# Altium schematic sheet 6_ZynTra-Zynq-DDR Interface.SchDoc
size 381 x 228 mm; SheetNumber: 6; SheetTotal: 10
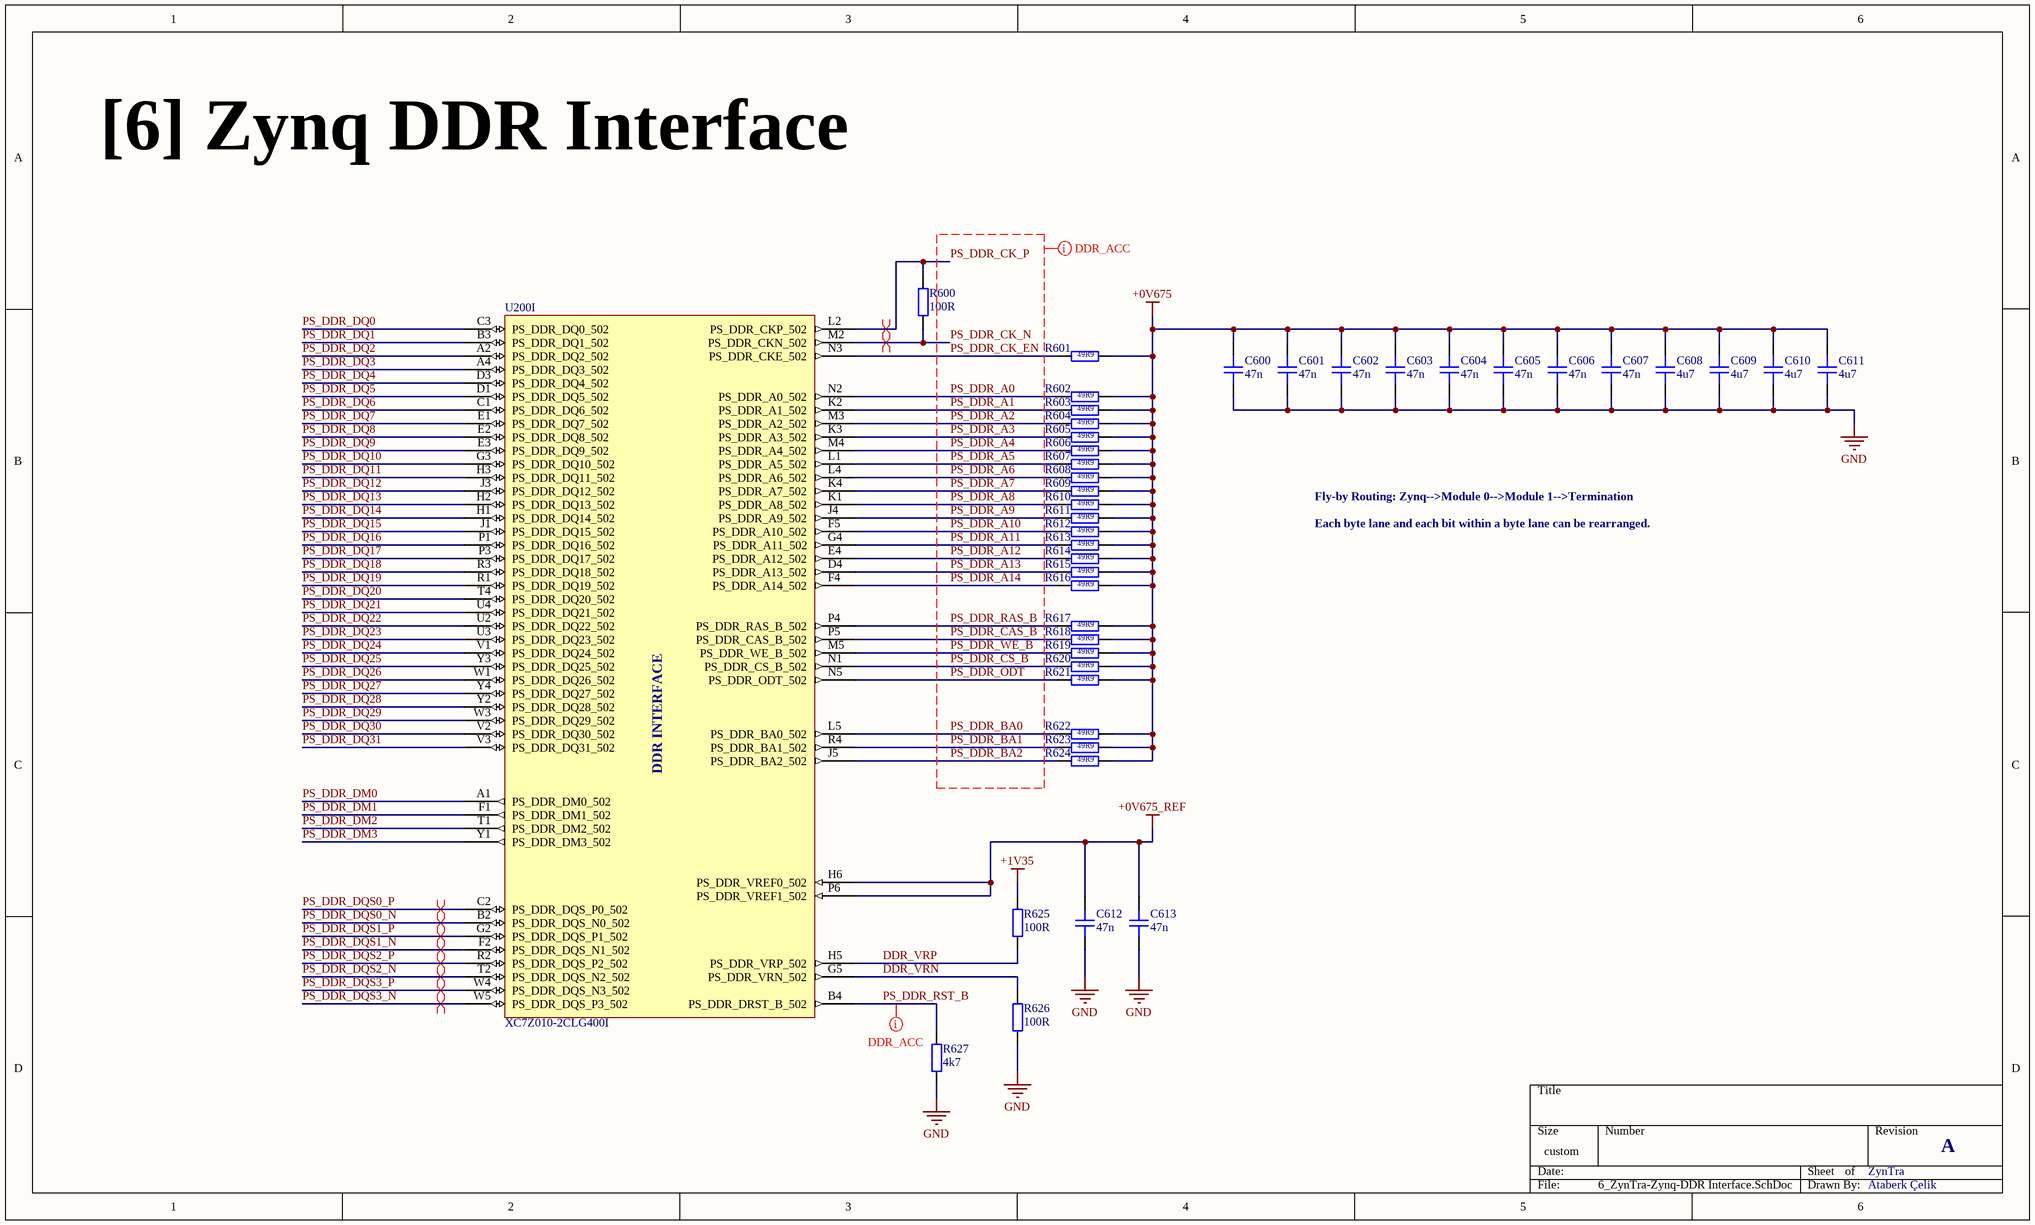
[diagram p0: 6_ZynTra-Zynq-DDR Interface.SchDoc]

## Parts
C600  47n  [CAP_0201]
C601  47n  [CAP_0201]
C602  47n  [CAP_0201]
C603  47n  [CAP_0201]
C604  47n  [CAP_0201]
C605  47n  [CAP_0201]
C606  47n  [CAP_0201]
C607  47n  [CAP_0201]
C608  4u7  [CAP_0402]
C609  4u7  [CAP_0402]
C610  4u7  [CAP_0402]
C611  4u7  [CAP_0402]
C612  47n  [CAP_0201]
C613  47n  [CAP_0201]
R600  100R  [RES_0201]
R601  49R9  [RES_0201]
R602  49R9  [RES_0201]
R603  49R9  [RES_0201]
R604  49R9  [RES_0201]
R605  49R9  [RES_0201]
R606  49R9  [RES_0201]
R607  49R9  [RES_0201]
R608  49R9  [RES_0201]
R609  49R9  [RES_0201]
R610  49R9  [RES_0201]
R611  49R9  [RES_0201]
R612  49R9  [RES_0201]
R613  49R9  [RES_0201]
R614  49R9  [RES_0201]
R615  49R9  [RES_0201]
R616  49R9  [RES_0201]
R617  49R9  [RES_0201]
R618  49R9  [RES_0201]
R619  49R9  [RES_0201]
R620  49R9  [RES_0201]
R621  49R9  [RES_0201]
R622  49R9  [RES_0201]
R623  49R9  [RES_0201]
R624  49R9  [RES_0201]
R625  100R  [RES_0201]
R626  100R  [RES_0201]
R627  4k7  [RES_0201]
U200  XC7Z010-2CLG400I  [CLG400, 0.8mm, 17x17]  (part I of 9)

## Nets
+0V675: C600.2 C601.2 C602.2 C603.2 C604.2 C605.2 C606.2 C607.2 C608.2 C609.2 C610.2 C611.2 R601.2 R602.2 R603.2 R604.2 R605.2 R606.2 R607.2 R608.2 R609.2 R610.2 R611.2 R612.2 R613.2 R614.2 R615.2 R616.2 R617.2 R618.2 R619.2 R620.2 R621.2 R622.2 R623.2 R624.2
+0V675_REF: C612.2 C613.2 U200.H6(PS_DDR_VREF0_502) U200.P6(PS_DDR_VREF1_502)
+1V35: R625.2
GND: C600.1 C601.1 C602.1 C603.1 C604.1 C605.1 C606.1 C607.1 C608.1 C609.1 C610.1 C611.1 C612.1 C613.1 R626.1 R627.1
DDR_VRN: R626.2 U200.G5(PS_DDR_VRN_502)
DDR_VRP: R625.1 U200.H5(PS_DDR_VRP_502)
PS_DDR_A0: R602.1 U200.N2(PS_DDR_A0_502)
PS_DDR_A1: R603.1 U200.K2(PS_DDR_A1_502)
PS_DDR_A2: R604.1 U200.M3(PS_DDR_A2_502)
PS_DDR_A3: R605.1 U200.K3(PS_DDR_A3_502)
PS_DDR_A4: R606.1 U200.M4(PS_DDR_A4_502)
PS_DDR_A5: R607.1 U200.L1(PS_DDR_A5_502)
PS_DDR_A6: R608.1 U200.L4(PS_DDR_A6_502)
PS_DDR_A7: R609.1 U200.K4(PS_DDR_A7_502)
PS_DDR_A8: R610.1 U200.K1(PS_DDR_A8_502)
PS_DDR_A9: R611.1 U200.J4(PS_DDR_A9_502)
PS_DDR_A10: R612.1 U200.F5(PS_DDR_A10_502)
PS_DDR_A11: R613.1 U200.G4(PS_DDR_A11_502)
PS_DDR_A12: R614.1 U200.E4(PS_DDR_A12_502)
PS_DDR_A13: R615.1 U200.D4(PS_DDR_A13_502)
PS_DDR_A14: R616.1 U200.F4(PS_DDR_A14_502)
PS_DDR_BA0: R622.1 U200.L5(PS_DDR_BA0_502)
PS_DDR_BA1: R623.1 U200.R4(PS_DDR_BA1_502)
PS_DDR_BA2: R624.1 U200.J5(PS_DDR_BA2_502)
PS_DDR_CAS_B: R618.1 U200.P5(PS_DDR_CAS_B_502)
PS_DDR_CK_EN: R601.1 U200.N3(PS_DDR_CKE_502)
PS_DDR_CK_N: R600.1 U200.M2(PS_DDR_CKN_502)
PS_DDR_CK_P: R600.2 U200.L2(PS_DDR_CKP_502)
PS_DDR_CS_B: R620.1 U200.N1(PS_DDR_CS_B_502)
PS_DDR_DM0: U200.A1(PS_DDR_DM0_502)
PS_DDR_DM1: U200.F1(PS_DDR_DM1_502)
PS_DDR_DM2: U200.T1(PS_DDR_DM2_502)
PS_DDR_DM3: U200.Y1(PS_DDR_DM3_502)
PS_DDR_DQ0: U200.C3(PS_DDR_DQ0_502)
PS_DDR_DQ1: U200.B3(PS_DDR_DQ1_502)
PS_DDR_DQ2: U200.A2(PS_DDR_DQ2_502)
PS_DDR_DQ3: U200.A4(PS_DDR_DQ3_502)
PS_DDR_DQ4: U200.D3(PS_DDR_DQ4_502)
PS_DDR_DQ5: U200.D1(PS_DDR_DQ5_502)
PS_DDR_DQ6: U200.C1(PS_DDR_DQ6_502)
PS_DDR_DQ7: U200.E1(PS_DDR_DQ7_502)
PS_DDR_DQ8: U200.E2(PS_DDR_DQ8_502)
PS_DDR_DQ9: U200.E3(PS_DDR_DQ9_502)
PS_DDR_DQ10: U200.G3(PS_DDR_DQ10_502)
PS_DDR_DQ11: U200.H3(PS_DDR_DQ11_502)
PS_DDR_DQ12: U200.J3(PS_DDR_DQ12_502)
PS_DDR_DQ13: U200.H2(PS_DDR_DQ13_502)
PS_DDR_DQ14: U200.H1(PS_DDR_DQ14_502)
PS_DDR_DQ15: U200.J1(PS_DDR_DQ15_502)
PS_DDR_DQ16: U200.P1(PS_DDR_DQ16_502)
PS_DDR_DQ17: U200.P3(PS_DDR_DQ17_502)
PS_DDR_DQ18: U200.R3(PS_DDR_DQ18_502)
PS_DDR_DQ19: U200.R1(PS_DDR_DQ19_502)
PS_DDR_DQ20: U200.T4(PS_DDR_DQ20_502)
PS_DDR_DQ21: U200.U4(PS_DDR_DQ21_502)
PS_DDR_DQ22: U200.U2(PS_DDR_DQ22_502)
PS_DDR_DQ23: U200.U3(PS_DDR_DQ23_502)
PS_DDR_DQ24: U200.V1(PS_DDR_DQ24_502)
PS_DDR_DQ25: U200.Y3(PS_DDR_DQ25_502)
PS_DDR_DQ26: U200.W1(PS_DDR_DQ26_502)
PS_DDR_DQ27: U200.Y4(PS_DDR_DQ27_502)
PS_DDR_DQ28: U200.Y2(PS_DDR_DQ28_502)
PS_DDR_DQ29: U200.W3(PS_DDR_DQ29_502)
PS_DDR_DQ30: U200.V2(PS_DDR_DQ30_502)
PS_DDR_DQ31: U200.V3(PS_DDR_DQ31_502)
PS_DDR_DQS0_N: U200.B2(PS_DDR_DQS_N0_502)
PS_DDR_DQS0_P: U200.C2(PS_DDR_DQS_P0_502)
PS_DDR_DQS1_N: U200.F2(PS_DDR_DQS_N1_502)
PS_DDR_DQS1_P: U200.G2(PS_DDR_DQS_P1_502)
PS_DDR_DQS2_N: U200.T2(PS_DDR_DQS_N2_502)
PS_DDR_DQS2_P: U200.R2(PS_DDR_DQS_P2_502)
PS_DDR_DQS3_N: U200.W5(PS_DDR_DQS_P3_502)
PS_DDR_DQS3_P: U200.W4(PS_DDR_DQS_N3_502)
PS_DDR_ODT: R621.1 U200.N5(PS_DDR_ODT_502)
PS_DDR_RAS_B: R617.1 U200.P4(PS_DDR_RAS_B_502)
PS_DDR_RST_B: R627.2 U200.B4(PS_DDR_DRST_B_502)
PS_DDR_WE_B: R619.1 U200.M5(PS_DDR_WE_B_502)

## Layout directives
differential pair: PS_DDR_CK_N, PS_DDR_CK_P, PS_DDR_DQS0_N, PS_DDR_DQS0_P, PS_DDR_DQS1_N, PS_DDR_DQS1_P, PS_DDR_DQS2_N, PS_DDR_DQS2_P, PS_DDR_DQS3_N, PS_DDR_DQS3_P
net class DDR_ACC; rule Matched Net Lengths [Delay Tolerance = 10ps]: PS_DDR_A0, PS_DDR_A1, PS_DDR_A2, PS_DDR_A3, PS_DDR_A4, PS_DDR_A5, PS_DDR_A6, PS_DDR_A7, PS_DDR_A8, PS_DDR_A9, PS_DDR_A10, PS_DDR_A11, PS_DDR_A12, PS_DDR_A13, PS_DDR_A14, PS_DDR_BA0, PS_DDR_BA1, PS_DDR_BA2, PS_DDR_CAS_B, PS_DDR_CK_EN, PS_DDR_CK_N, PS_DDR_CK_P, PS_DDR_CS_B, PS_DDR_ODT, PS_DDR_RAS_B, PS_DDR_RST_B, PS_DDR_WE_B

## Notes on the sheet
- [6] Zynq DDR Interface
- Fly-by Routing: Zynq-->Module 0-->Module 1-->Termination
- Each byte lane and each bit within a byte lane can be rearranged.
- ZynTra
- A
- Ataberk Çelik
- (in symbol XC7Z010-2CLG400I, part I) DDR INTERFACE

## Library data of the parts
C600-C607 C612 C613 = CAP_0201: Capacitor SMD 0201; Manufacturer: *; Manufacturer Part Number: *; Distributor Link: *; LCSC: *; Rating: *; Dielectric: *
C608-C611 = CAP_0402: Capacitor SMD 0402; Manufacturer: *; Manufacturer Part Number: *; Distributor Link: *; LCSC: *; Rating: *; Dielectric: *
R600-R627 = RES_0201: Resistor SMD 0201; Manufacturer: *; Manufacturer Part Number: *; Distributor Link: *; LCSC: *
U200 = XC7Z010-2CLG400I: Zynq 7000S SoC devices feature a single-core Arm® Cortex®-A9 processor mated with 28 nm AMD Artix™ 7 based programmable logic, representing a low cost entry point to the scalable Zynq 7000 platform. Available with 6.25 Gb/s transceivers and outfitted with commonly used hardened peripherals, the Zynq 7000S delivers cost-optimized system integration ideal for industrial IoT applications such as motor control and embedded vision.; Manufacturer: AMD / Xilinx; Manufacturer Part Number: XC7Z010-2CLG400I; Supplier Link: https://www.mouser.com.tr/ProductDetail/AMD-Xilinx/XC7Z010-2CLG400I?qs=rrS6PyfT74cETvLeyRFHTA%3D%3D